# EAGLE design ba1404 (EAGLE 5.11)
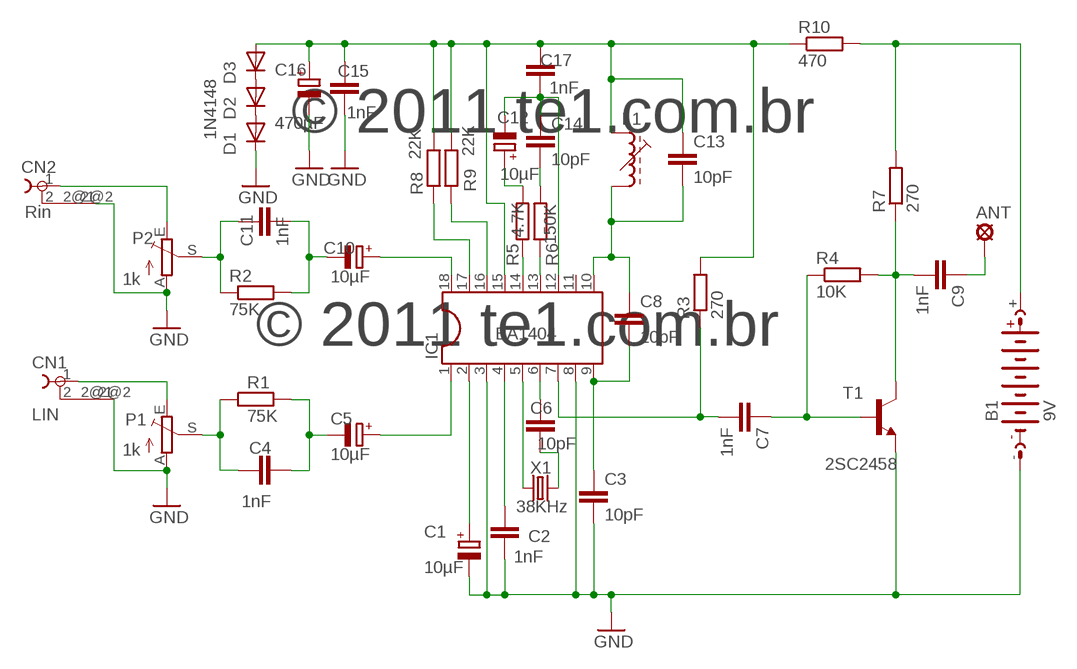
[diagram p0: schematic, sheet 1]

## Parts
ANT  SE14  [SE14]
B1  9V  AB9V  [AB9V]
C1  10µF  CPOL-EUE2.5-5  [E2,5-5]
C2  1nF  C-EU050-024X044  [C050-024X044]
C3  10pF  C-EU025-025X050  [C025-025X050]
C4  1nF  C5/3.5  [C5B3.5]
C5  10µF  CPOL-EUE2.5-5  [E2,5-5]
C6  10pF  C-EU025-025X050  [C025-025X050]
C7  1nF  C-EU050-024X044  [C050-024X044]
C8  10pF  C-EU025-025X050  [C025-025X050]
C9  1nF  C-EU050-024X044  [C050-024X044]
C10  10µF  CPOL-EUE2.5-5  [E2,5-5]
C11  1nF  C5/3.5  [C5B3.5]
C12  10µF  CPOL-EUE2.5-5  [E2,5-5]
C13  10pF  C-EU025-025X050  [C025-025X050]
C14  10pF  C-EU025-025X050  [C025-025X050]
C15  1nF  C-EU050-024X044  [C050-024X044]
C16  470µF  CPOL-EUE3.5-8  [E3,5-8]
C17  1nF  C-EU050-024X044  [C050-024X044]
CN1  LIN  TOBU3  [TOBU3]
CN2  Rin  TOBU3  [TOBU3]
D1  1N4148  1N4148DO35-10  [DO35-10]
D2  1N4148DO35-10  [DO35-10]
D3  1N4148DO35-10  [DO35-10]
IC1  BA1404  DIL18  [DIL18]
L1  71E  [71E]
P1  1k  TRIM_EU-B25P  [B25P]
P2  1k  TRIM_EU-B25P  [B25P]
R1  75K  R-EU_0207/10  [0207/10]
R2  75K  R-EU_0207/10  [0207/10]
R3  270  R-EU_0207/10  [0207/10]
R4  10K  R-EU_0207/10  [0207/10]
R5  4.7K  R-EU_0207/10  [0207/10]
R6  150K  R-EU_0207/10  [0207/10]
R7  270  R-EU_0207/10  [0207/10]
R8  22K  R-EU_0207/10  [0207/10]
R9  22K  R-EU_0207/10  [0207/10]
R10  470  R-EU_0207/10  [0207/10]
T1  2SC2458  BF199-NPN-TO92-BEC  [TO92-BEC]
X1  38KHz  CRYTALTC26V  [TC26V]

## Nets
GND: B1.- C1.- C2.1 C3.2 C15.1 C16.- CN1.2@2 CN2.2@2 D1.C IC1.3 IC1.8 P1.A P2.A T1.E
N$1: C10.+ IC1.18
N$2: C5.+ IC1.1
N$3: C10.- C11.2 R2.2
N$4: C4.2 C5.- R1.2
N$5: C1.+ IC1.2
N$6: IC1.5 X1.1
N$7: C6.2 X1.2
N$8: C2.2 IC1.4
N$9: IC1.16 R9.1
N$10: C6.1 IC1.6
N$11: C8.1 C13.2 IC1.10 L1.E
N$12: B1.+ R7.2 R10.2
N$13: C3.1 C8.2 IC1.9
N$14: C13.1 C15.2 C16.+ C17.2 D3.A IC1.15 L1.A R3.2 R8.2 R9.2 R10.1
N$15: IC1.13 R6.1
N$16: C11.1 P2.S R2.1
N$17: C12.+ R5.2
N$18: IC1.14 R5.1
N$19: C14.2 R6.2
N$20: C12.- C14.1 C17.1 IC1.12
N$21: C4.1 P1.S R1.1
N$22: D1.A D2.C
N$23: D2.A D3.C
N$24: C7.1 R4.1 T1.B
N$25: C9.2 R4.2 R7.1 T1.C
N$26: C7.2 IC1.7 R3.1
N$29: ANT.MP C9.1
N$30: CN2.1 P2.E
N$31: CN1.1 P1.E
N$32: IC1.17 R8.1
Unconnected: CN1.2 CN1.2@1 CN2.2 CN2.2@1 IC1.11

## Notes on the sheet
- © 2011 te1.com.br
- © 2011 te1.com.br

## Library data of the parts
ANT = solpad:SE14: SOLDER PAD E1553, drill 1,4mm, distributor Buerklin, 07F820
B1 = battery:AB9V: 9-V BATTERY CLIP
C1 C5 C10 C12 C16 = rcl:CPOL-EU: POLARIZED CAPACITOR, European symbol
C2 C3 C6-C9 C13-C15 C17 = rcl:C-EU: CAPACITOR, European symbol
C4 C11 = capacitor-wima:C: CAPACITOR naming: grid - package width
CN1 CN2 = con-hirschmann:TOBU3: Female Cinch CONNECTOR ( RCA Jack ); MF: FARNELL; MPN: TOBU 3; OC_FARNELL: 592791; OC_NEWARK: 06WX5914
D1-D3 = diode:1N4148: DIODE high speed (Philips)
IC1 = ic-package:DIL18: Dual In Line / Socket
L1 = inductor-fm:71E: FILTER adjustable filter coil, Type E; OC_FARNELL: unknown; OC_NEWARK: unknown
P1 P2 = pot:TRIM_EU-: POTENTIOMETER
R1-R10 = rcl:R-EU_: RESISTOR, European symbol
T1 = transistor:*-NPN-: NPN Transistror BF959 corrected 2008.03.06
X1 = crystal2:CRYTAL: CRYSTAL

## Board
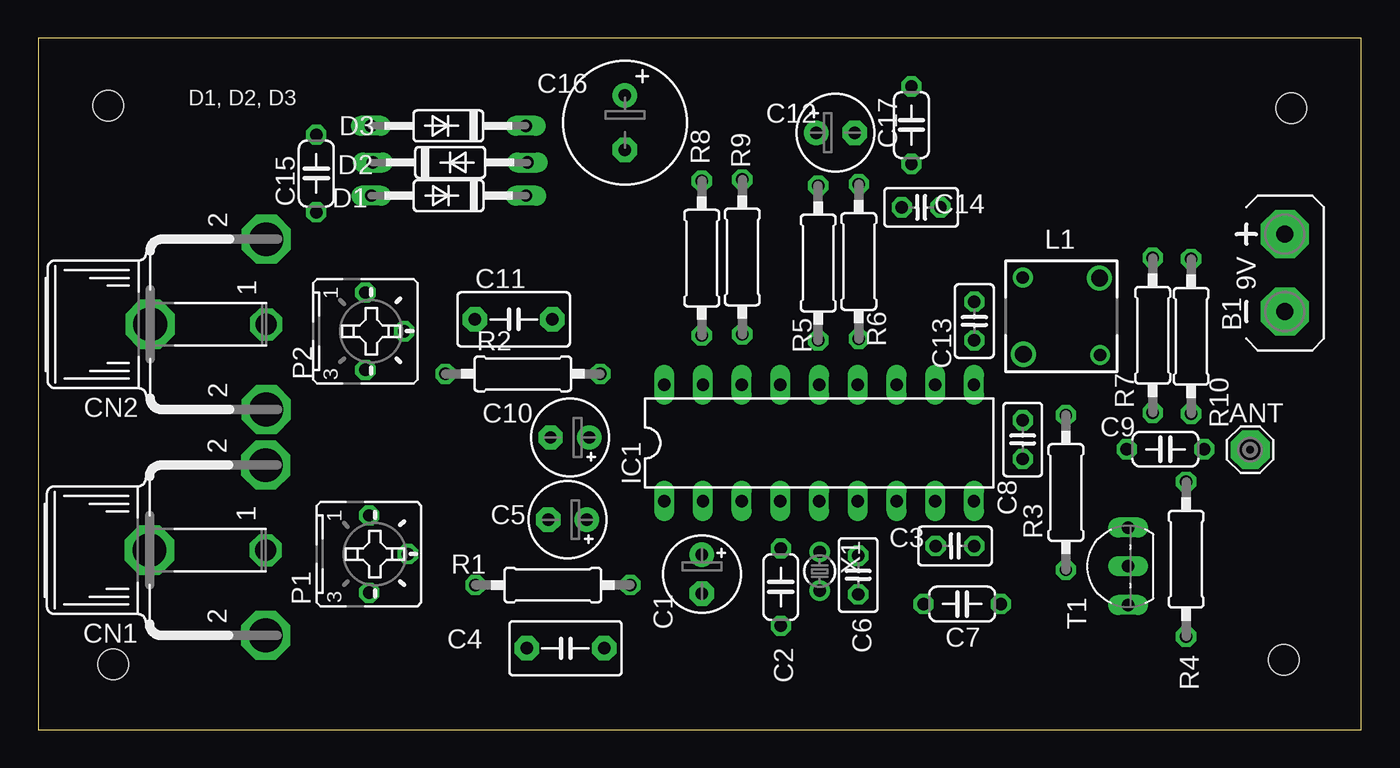
[diagram p1: board, top side]
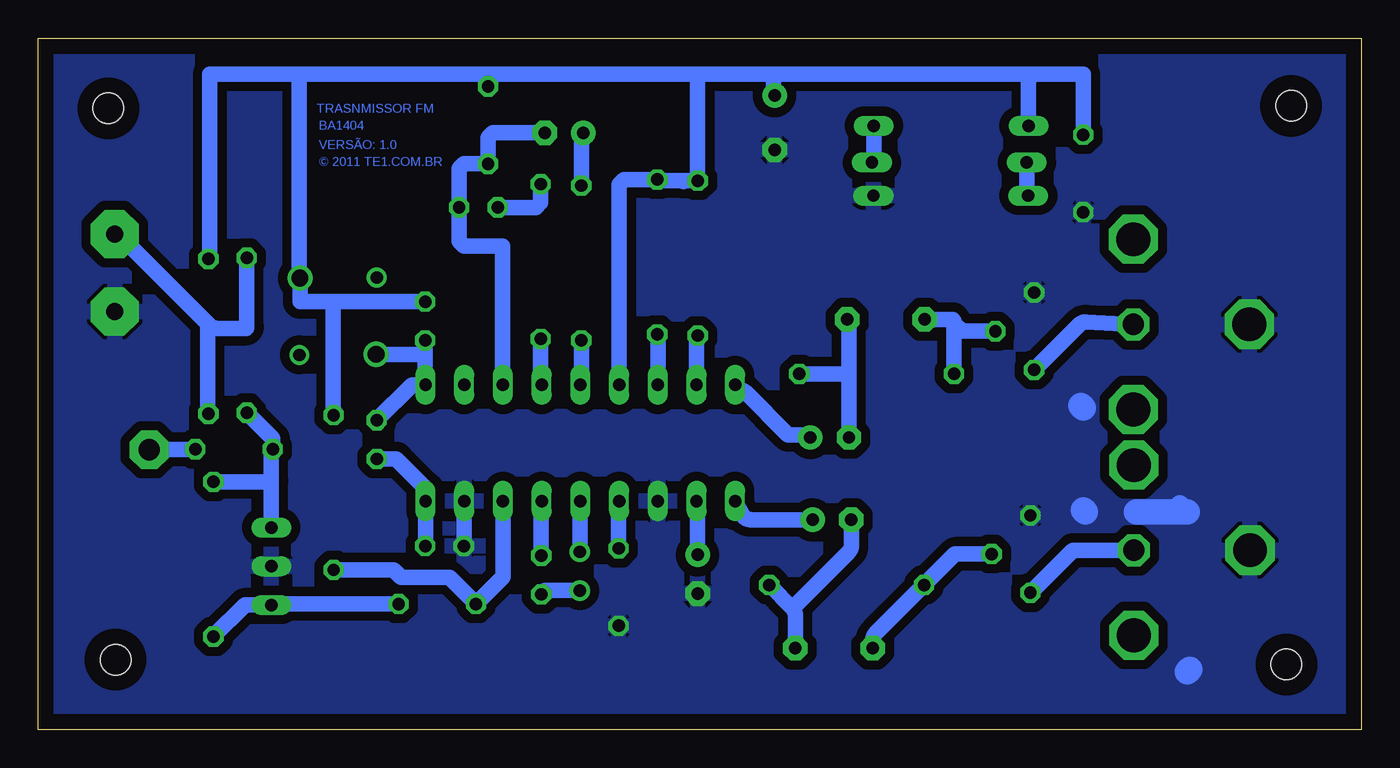
[diagram p2: board, bottom side, seen from below]

Size 86.84 x 45.4 mm. Coordinates in mm from the lower left corner, seen from the top.
Outline: 0,45.4 0,0 86.84,0 86.84,45.4 0,45.4
Copper layers (1*16): Top 0.035mm / dielectric 1.5mm / Bottom 0.035mm
Design rules "default": minimum track width 10mil, minimum drill 24mil, track to track 8mil, track to pad 8mil, pad to pad 8mil, via to via 8mil, smd to smd 8mil, copper to edge 40mil, drill to drill 8mil, minimum pad ring 10mil, minimum via ring 8mil, stop-mask expansion 4mil, vias tented up to drill 0mil, thermal gap 10mil
Holes 2 mm at 4.6,40.96 4.92,4.29 81.76,4.6 82.23,40.8

### Footprints (pad centres in the part's own frame; a part is rotated, then mirrored left to right if it is on the bottom)
SE14 = drill 1.397 pad 2.54 octagon: MP 0,0
AB9V = drill 1.118 pad 3.15 octagon: + 0,2.54; - 0,-2.54
E2,5-5 = drill 0.813 pad 1.6 round: + -1.27,0 | drill 0.813 pad 1.6 octagon: - 1.27,0
C050-024X044 = drill 0.813 octagon: 1 -2.54,0; 2 2.54,0
C025-025X050 = drill 0.813 octagon: 1 -1.27,0; 2 1.27,0
C5B3.5 = drill 0.813 pad 1.6 octagon: 1 -2.54,0; 2 2.54,0
E3,5-8 = drill 0.813 pad 1.6 round: + -1.778,0 | drill 0.813 pad 1.6 octagon: - 1.778,0
TOBU3 = drill 1.397 octagon: 1 0,-2.54 | drill 2.21 octagon: 2 5.588,-2.54; 2@1 -5.588,-2.54; 2@2 0,5.08
DO35-10 = drill 0.813 long: A 5.08,0; C -5.08,0
DIL18 = drill 0.813 long: 1 -10.16,-3.81; 2 -7.62,-3.81; 3 -5.08,-3.81; 4 -2.54,-3.81; 5 0,-3.81; 6 2.54,-3.81; 7 5.08,-3.81; 8 7.62,-3.81; 9 10.16,-3.81; 10 10.16,3.81; 11 7.62,3.81; 12 5.08,3.81; 13 2.54,3.81; 14 0,3.81; 15 -2.54,3.81; 16 -5.08,3.81; 17 -7.62,3.81; 18 -10.16,3.81
71E = drill 1.1 round: A 2.5,2.5; E -2.5,-2.5 | drill 0.8 round: P$1 -2.54,2.54; P$2 2.54,-2.54
B25P = drill 0.813 octagon: A -2.54,0; E 2.54,0; S 0,2.54
0207/10 = drill 0.813 octagon: 1 -5.08,0; 2 5.08,0
TO92-BEC = drill 0.813 long: B -2.54,0; C 2.54,0; E 0,0
TC26V = drill 0.813 round: 1 -1.27,0; 2 1.27,0

### Placement (x,y rotation side)
ANT  79.54,18.38 0 top
B1  81.82,29.99 0 top
C1  43.56,10.22 270 top
C2  48.74,9.37 90 top
C3  60.17,12.06 180 top
C4  34.61,5.35 0 top
C5  34.74,13.79 180 top
C6  53.82,10.16 270 top
C7  60.64,8.25 180 top
C8  64.61,19.05 270 top
C9  73.98,18.41 180 top
C10  34.9,19.19 180 top
C11  31.21,26.94 0 top
C12  52.32,39.19 0 top
C13  61.44,26.83 270 top
C14  57.94,34.29 180 top
C15  18.26,36.51 90 top
C16  38.51,39.85 270 top
C17  57.31,39.69 90 top
CN1  12.39,11.79 90 top
CN2  12.43,26.61 90 top
D1  26.94,35.06 180 top
D2  27.04,37.24 0 top
D3  26.92,39.64 180 top
IC1  51.25,18.83 0 top
L1  67.15,27.15 0 top
P1  21.72,11.53 270 top
P2  21.48,26.16 270 top
R1  33.78,9.5 0 top
R2  31.81,23.36 0 top
R3  67.45,15.57 90 top
R4  75.33,11.2 90 top
R5  51.19,30.64 90 top
R6  53.86,30.74 90 top
R7  73.14,25.89 90 top
R8  43.55,30.95 90 top
R9  46.21,31.03 90 top
R10  75.66,25.83 270 top
T1  71.53,10.73 90 top
X1  51.29,10.4 270 top

### Tracks (layer width: path | path; a pad name or v marks a point on that pad's centre or on a via)
GND
  Bottom 1.016: IC1.8 58.87,12.09 C3.2
  Bottom 1.27: 11.75,14.6 11.91,14.76
  Bottom 1.676: 18.42,21.27 18.26,21.11 | 11.43,14.29 14.76,14.29 | 18.26,14.45 18.1,14.29 | 11.43,3.81 11.27,3.97
  pour Bottom (isolate 0.61): 0.95,44.13 0.79,0.95 85.73,0.95 85.73,44.13
N$1
  Bottom 1.016: IC1.18 40.84,22.32 arc45 40.39,22.13 37.62,19.37 36.6,19.37 arc45 C10.+
N$2
  Bottom 1.016: C5.+ 40.08,13.79 arc45 40.53,13.98 IC1.1
N$3
  Bottom 1.016: C10.- 33.63,23.18 | 33.63,23.18 33.63,26.65 arc-45 C11.2 | R2.2 34.07,23.36 arc45 33.63,23.18
N$4
  Bottom 1.016: C4.2 37.15,7.53 arc-45 37.34,7.98 | 37.34,7.98 R1.2 | C5.- 33.47,12.1 arc45 33.66,11.66 37.34,7.98
N$5
  Bottom 1.016: IC1.2 43.56,14.95 C1.+
N$6
  Bottom 1.016: IC1.5 51.29,14.98 X1.1
N$7
  Bottom 1.016: X1.2 53.57,9.13 C6.2
N$8
  Bottom 1.016: IC1.4 48.74,14.99 C2.2
N$9
  Bottom 1.016: IC1.16 46.17,25.92 R9.1
N$10
  Bottom 1.016: IC1.6 53.82,14.99 C6.1
N$11
  Bottom 1.016: 61.44,24.65 61.44,24.92 | 61.44,24.92 C13.2 | C8.1 62.29,22.64 IC1.10 61.44,22.66 61.44,24.61 61.44,24.65 | 61.44,24.92 61.46,24.9 | 61.44,24.65 L1.E
N$12
  Bottom 1.016: B1.+ arc45 81.41,32.36 75.72,26.67 | 75.72,26.67 75.72,20.9 arc-45 R10.2 | R7.2 73.14,26.46 arc45 73.18,26.35 75.14,26.35 arc45 75.59,26.54 75.72,26.67
N$13
  Bottom 1.016: C3.1 61.41,12.09 IC1.9 61.44,15.04 61.44,15.87 63.34,17.78 C8.2
N$14
  Bottom 1.016: C15.2 18.26,43.02 21.52,43.02 | 21.52,43.02 21.84,42.7 D3.A | C16.+ 38.58,41.7 38.58,43.02 | 21.52,43.02 38.58,43.02 | C17.2 | 57.31,43.02 C17.2 | 38.58,43.02 43.66,43.02 | 43.66,43.02 57.31,43.02 | R10.1 75.57,31 75.57,43.02 69.69,43.02 | 57.31,43.02 69.69,43.02 | R3.2 67.31,20.79 67.47,20.79 67.47,28.1 | IC1.15 48.71,35.8 48.39,36.11 R9.2 46.13,36.03 44.45,36.03 | 44.45,36.03 R8.2 43.55,42.91 43.66,43.02 | 44.45,36.03 44.5,35.98 | 67.47,28.1 C13.1 | 67.47,28.1 69.65,28.1 L1.A 69.69,29.65 69.69,43.02
N$15
  Bottom 1.016: IC1.13 arc90 53.86,22.86 R6.1
N$16
  Bottom 1.016: C11.1 26.83,26.94 arc45 26.73,26.7 | 26.73,26.7 R2.1 | P2.S 26.19,26.16 26.73,26.7
N$17
  Bottom 1.016: R5.2 51.19,39.05 C12.+
N$18
  Bottom 1.016: IC1.14 arc90 51.19,22.74 R5.1
N$19
  Bottom 1.016: R6.2 53.86,34.61 54.17,34.29 C14.2
N$20
  Bottom 1.016: IC1.12 56.36,22.66 56.36,31.75 58.9,31.75 59.21,32.07 C14.1 59.21,36.83 58.9,37.15 C17.1 57.31,38.87 56.99,39.19 C12.-
N$21
  Bottom 1.016: R1.1 arc-45 28.63,9.47 | C4.1 32.07,5.87 arc45 31.88,6.32 R1.1 | P1.S 26.67,11.53 R1.1
N$22
  Bottom 1.016: D1.A arc90 21.96,35.16 D2.C
N$23
  Bottom 1.016: D2.A arc-90 32,37.36 D3.C
N$24
  Bottom 1.016: C7.1 71.47,8.25 T1.B 73.26,8.19 R4.1
N$25
  Bottom 1.016: T1.C 71.53,16.35 | 71.53,16.35 71.53,18.32 C9.2 71.44,19.11 R7.1 | R4.2 71.6,16.28 71.53,16.35
N$26
  Bottom 1.016: IC1.7 56.33,10.03 C7.2 59.85,10 63.02,10 63.52,10.49 R3.1
N$29
  Bottom 1.016: C9.1 79.51,18.41 ANT.MP
N$30
  Bottom 1.016: CN2.1 18.07,26.77 arc-45 18.52,26.58 P2.E
N$31
  Bottom 1.016: CN1.1 18.93,11.79 P1.E
N$32
  Bottom 1.016: IC1.17 43.63,25.79 R8.1

### Text on the board
Bottom: TRASNMISSOR FM | BA1404 | VERSÃO: 1.0 | © 2011 TE1.COM.BR
tNames: D1, D2, D3
Holes: © 2011 te1.com.br | © 2011 te1.com.br | © 2011 te1.com.br